# Altium schematic sheet fmu.SchDoc: myA4
size A4; Date: 2018/03/30; DrawnBy: 亓岳鑫; Organization: Altium Limited; Address1: 3 Minna Close; Address2: Belrose; Address3: NSW 2085; Address4: Australia; DocumentNumber: 4; Revision: Alfa 2.0; SheetNumber: 4; SheetTotal: 6; Time: 17:30
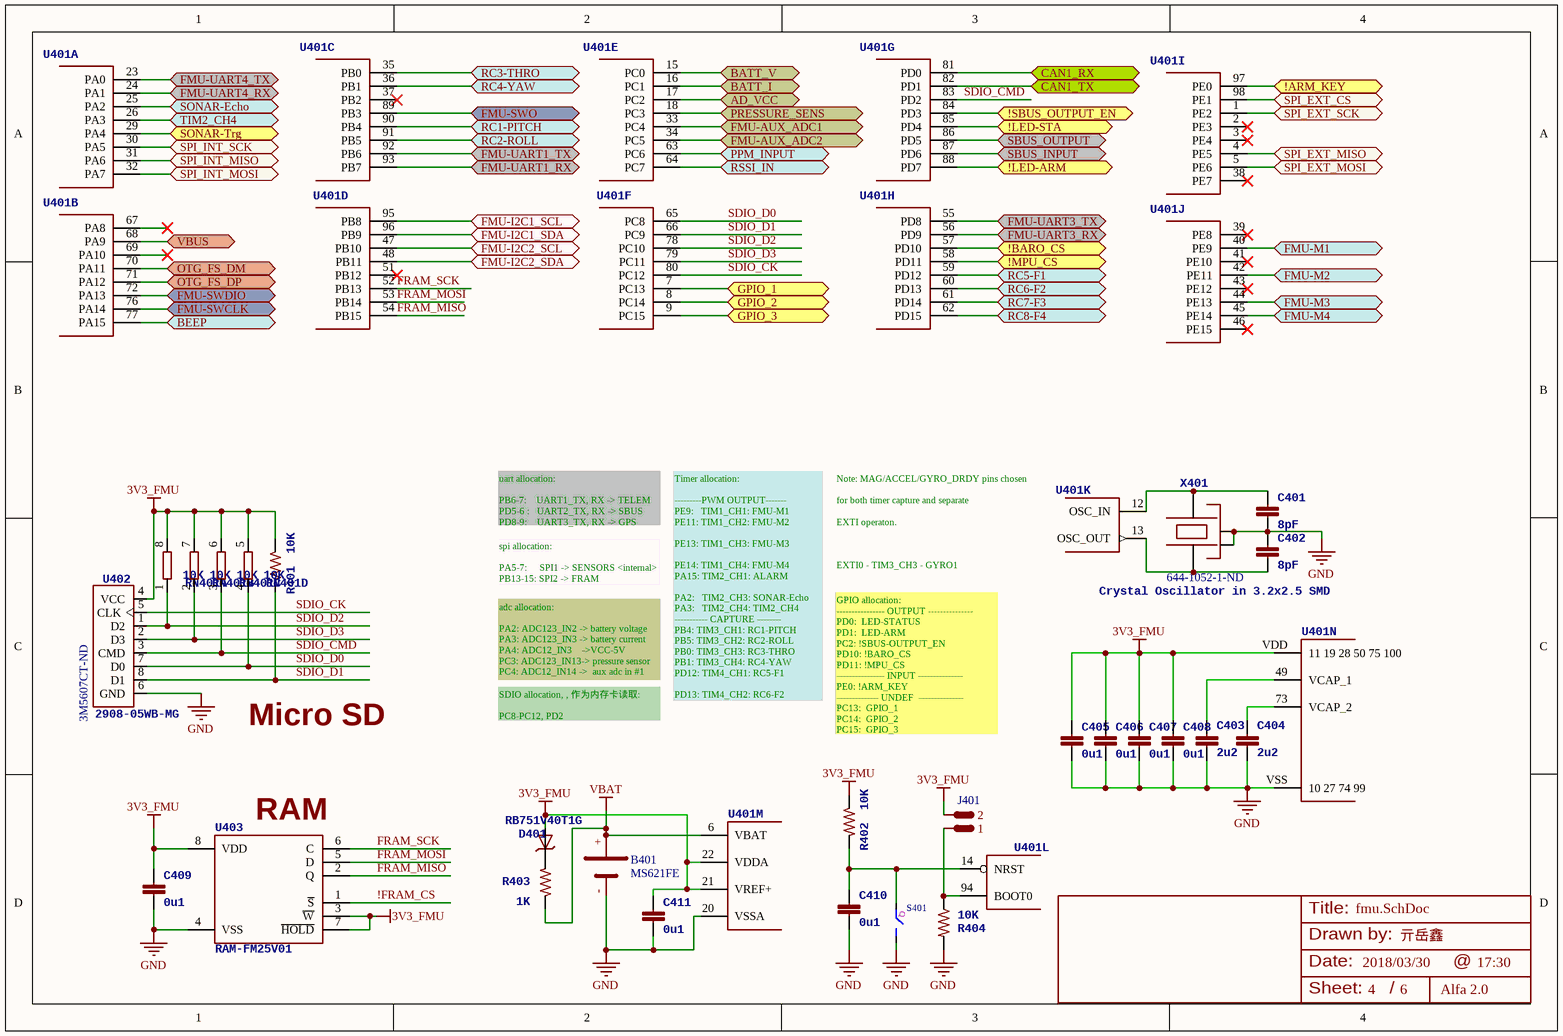
[diagram p0: fmu.SchDoc]

## Parts
B401  MS621FE  [MS621FE]
C401  8pF  [0603-CAP]
C402  8pF  [0603-CAP]
C403  2u2  [0603-CAP]
C404  2u2  [0603-CAP]
C405  0u1  [0603-CAP]
C406  0u1  [0603-CAP]
C407  0u1  [0603-CAP]
C408  0u1  [0603-CAP]
C409  0u1  [0603-CAP]
C410  0u1  [0603-CAP]
C411  0u1  [0603-CAP]
D401  RB751V40T1G  [SOD-323]
J401  HDR 2X1  [HDR2X1]  (value not drawn)
R401  10K  [0603-RES]
R402  10K  [0603-RES]
R403  1K  [0603-RES]
R404  10K  [0603-RES]
RN401  10K  [0603*4]  (parts A,B,C,D of 4)
S401  轻触开关 贴片3*6*2.5mm  [SMD-SWITCH-2P]  (value not drawn)
U401  STM32F427VI qfp 100 pin  [LQFP100]  (value not drawn)  (parts A,B,C,D,E,F,G,H,I,J,K,L,M,N of 14)
U402  2908-05WB-MG  Supplier Part Number 1: 3M5607CT-ND  [MICROSD]
U403  RAM-FM25V01  [SO08]
X401  Crystal Oscillator in 3.2x2.5 SMD  Supplier Part Number 1: 644-1052-1-ND  [3225-OSC]

## Ports
!ARM_KEY, !BARO_CS, !LED-ARM, !LED-STA, !MPU_CS, !SBUS_OUTPUT_EN, AD_VCC, BATT_I, BATT_V, BEEP, CAN1_RX, CAN1_TX, FMU-AUX_ADC1, FMU-AUX_ADC2, FMU-I2C1_SCL, FMU-I2C1_SDA, FMU-I2C2_SCL, FMU-I2C2_SDA, FMU-M1, FMU-M2, FMU-M3, FMU-M4, FMU-SWCLK, FMU-SWDIO, FMU-SWO, FMU-UART1_RX, FMU-UART1_TX, FMU-UART3_RX, FMU-UART3_TX, FMU-UART4_RX, FMU-UART4_TX, GPIO_1, GPIO_2, GPIO_3, OTG_FS_DM, OTG_FS_DP, PPM_INPUT, PRESSURE_SENS, RC1-PITCH, RC2-ROLL, RC3-THRO, RC4-YAW, RC5-F1, RC6-F2, RC7-F3, RC8-F4, RSSI_IN, SBUS_INPUT, SBUS_OUTPUT, SONAR-Echo, SONAR-Trg, SPI_EXT_CS, SPI_EXT_MISO, SPI_EXT_MOSI, SPI_EXT_SCK, SPI_INT_MISO, SPI_INT_MOSI, SPI_INT_SCK, TIM2_CH4, VBUS

## Nets
3V3_FMU: C405.P$1 C406.P$1 C407.P$1 C408.P$1 C409.P$1 C411.P$1 D401.A J401.2 R401.1 R402.1 RN401.5 RN401.6 RN401.7 RN401.8 U401.21(VREF+) U401.22(VDDA) U401.VDD(11_19_28_50_75_100) U402.4(VCC) U403.3(~{W}) U403.7(~{HOLD}) U403.8(VDD)
GND: B401.- C401.P$2 C402.P$1 C403.P$2 C404.P$2 C405.P$2 C406.P$2 C407.P$2 C408.P$2 C409.P$2 C410.P$2 C411.P$2 R404.2 S401.2 U401.20(VSSA) U401.VSS(10_27_74_99) U402.6(GND) U403.4(VSS) X401.2(NC_2) X401.4(NC_4)
VBAT: B401.+ R403.1 U401.6(VBAT)
!ARM_KEY: U401.97(PE0) ; port !ARM_KEY
!BARO_CS: U401.57(PD10) ; port !BARO_CS
!FRAM_CS: U403.1(~{S})
!LED-ARM: U401.88(PD7) ; port !LED-ARM
!LED-STA: U401.85(PD4) ; port !LED-STA
!MPU_CS: U401.58(PD11) ; port !MPU_CS
!SBUS_OUTPUT_EN: U401.84(PD3) ; port !SBUS_OUTPUT_EN
AD_VCC: U401.17(PC2) ; port AD_VCC
BATT_I: U401.16(PC1) ; port BATT_I
BATT_V: U401.15(PC0) ; port BATT_V
BEEP: U401.77(PA15) ; port BEEP
CAN1_RX: U401.81(PD0) ; port CAN1_RX
CAN1_TX: U401.82(PD1) ; port CAN1_TX
FMU-AUX_ADC1: U401.33(PC4) ; port FMU-AUX_ADC1
FMU-AUX_ADC2: U401.34(PC5) ; port FMU-AUX_ADC2
FMU-I2C1_SCL: U401.95(PB8) ; port FMU-I2C1_SCL
FMU-I2C1_SDA: U401.96(PB9) ; port FMU-I2C1_SDA
FMU-I2C2_SCL: U401.47(PB10) ; port FMU-I2C2_SCL
FMU-I2C2_SDA: U401.48(PB11) ; port FMU-I2C2_SDA
FMU-M1: U401.40(PE9) ; port FMU-M1
FMU-M2: U401.42(PE11) ; port FMU-M2
FMU-M3: U401.44(PE13) ; port FMU-M3
FMU-M4: U401.45(PE14) ; port FMU-M4
FMU-SWCLK: U401.76(PA14) ; port FMU-SWCLK
FMU-SWDIO: U401.72(PA13) ; port FMU-SWDIO
FMU-SWO: U401.89(PB3) ; port FMU-SWO
FMU-UART1_RX: U401.93(PB7) ; port FMU-UART1_RX
FMU-UART1_TX: U401.92(PB6) ; port FMU-UART1_TX
FMU-UART3_RX: U401.56(PD9) ; port FMU-UART3_RX
FMU-UART3_TX: U401.55(PD8) ; port FMU-UART3_TX
FMU-UART4_RX: U401.24(PA1) ; port FMU-UART4_RX
FMU-UART4_TX: U401.23(PA0) ; port FMU-UART4_TX
FRAM_MISO: U401.54(PB15) U403.2(Q)
FRAM_MOSI: U401.53(PB14) U403.5(D)
FRAM_SCK: U401.52(PB13) U403.6(C)
GPIO_1: U401.7(PC13) ; port GPIO_1
GPIO_2: U401.8(PC14) ; port GPIO_2
GPIO_3: U401.9(PC15) ; port GPIO_3
OTG_FS_DM: U401.70(PA11) ; port OTG_FS_DM
OTG_FS_DP: U401.71(PA12) ; port OTG_FS_DP
PPM_INPUT: U401.63(PC6) ; port PPM_INPUT
PRESSURE_SENS: U401.18(PC3) ; port PRESSURE_SENS
RC1-PITCH: U401.90(PB4) ; port RC1-PITCH
RC2-ROLL: U401.91(PB5) ; port RC2-ROLL
RC3-THRO: U401.35(PB0) ; port RC3-THRO
RC4-YAW: U401.36(PB1) ; port RC4-YAW
RC5-F1: U401.59(PD12) ; port RC5-F1
RC6-F2: U401.60(PD13) ; port RC6-F2
RC7-F3: U401.61(PD14) ; port RC7-F3
RC8-F4: U401.62(PD15) ; port RC8-F4
RSSI_IN: U401.64(PC7) ; port RSSI_IN
SBUS_INPUT: U401.87(PD6) ; port SBUS_INPUT
SBUS_OUTPUT: U401.86(PD5) ; port SBUS_OUTPUT
SDIO_CK: U401.80(PC12) U402.5(CLK)
SDIO_CMD: RN401.3 U401.83(PD2) U402.3(CMD)
SDIO_D0: RN401.4 U401.65(PC8) U402.7(D0)
SDIO_D1: R401.2 U401.66(PC9) U402.8(D1)
SDIO_D2: RN401.1 U401.78(PC10) U402.1(D2)
SDIO_D3: RN401.2 U401.79(PC11) U402.2(D3)
SONAR-Echo: U401.25(PA2) ; port SONAR-Echo
SONAR-Trg: U401.29(PA4) ; port SONAR-Trg
SPI_EXT_CS: U401.98(PE1) ; port SPI_EXT_CS
SPI_EXT_MISO: U401.4(PE5) ; port SPI_EXT_MISO
SPI_EXT_MOSI: U401.5(PE6) ; port SPI_EXT_MOSI
SPI_EXT_SCK: U401.1(PE2) ; port SPI_EXT_SCK
SPI_INT_MISO: U401.31(PA6) ; port SPI_INT_MISO
SPI_INT_MOSI: U401.32(PA7) ; port SPI_INT_MOSI
SPI_INT_SCK: U401.30(PA5) ; port SPI_INT_SCK
TIM2_CH4: U401.26(PA3) ; port TIM2_CH4
VBUS: U401.68(PA9) ; port VBUS
NetC401_P$1: C401.P$1 U401.12(OSC_IN) X401.3
NetC402_P$2: C402.P$2 U401.13(OSC_OUT) X401.1
NetC403_P$1: C403.P$1 U401.49(VCAP_1)
NetC404_P$1: C404.P$1 U401.73(VCAP_2)
NetC410_P$1: C410.P$1 R402.2 S401.1 U401.14(NRST)
NetD401_C: D401.C R403.2
NetJ401_1: J401.1 R404.1 U401.94(BOOT0)

Not connected (* = marked no-connect by the designer): U401 2(PE3)* 3(PE4)* 37(PB2)* 38(PE7)* 39(PE8)* 41(PE10)* 43(PE12)* 46(PE15)* 51(PB12)* 67(PA8)* 69(PA10)*

## Notes on the sheet
- uart allocation:
  PB6-7:    UART1_TX, RX -> TELEM
  PD5-6 :   UART2_TX, RX -> SBUS
  PD8-9:    UART3_TX, RX -> GPS
  PA0-1 :   UART4_TX, RX -> DEBUG
- spi allocation:
  PA5-7:     SPI1 -> SENSORS <internal>
  PB13-15: SPI2 -> FRAM
  PE2,5,6:  SPI4 -> external SPI
- Note: MAG/ACCEL/GYRO_DRDY pins chosen
  for both timer capture and separate
  EXTI operaton.
  EXTI0 - TIM3_CH3 - GYRO1
  EXTI1 - <free>
  EXTI2 - <free>
  EXTI3 - <free>
  EXTI4 - TIM3_CH1 - ACCEL
  EXTI5-9 - TIM3_CH2 - MAG
- adc allocation:
  PA2: ADC123_IN2 -> battery voltage
  PA3: ADC123_IN3 -> battery current
  PA4: ADC12_IN3    ->VCC-5V
  PC3: ADC123_IN13-> pressure sensor
  PC4: ADC12_IN14 ->  aux adc in #1
  PC5: ADC12_IN15  -> aux adc in #2
- SDIO allocation, , 作为内存卡读取:
  PC8-PC12, PD2
- Timer allocation:
  ---------PWM OUTPUT-------
  PE9:   TIM1_CH1: FMU-M1
  PE11: TIM1_CH2: FMU-M2
  PE13: TIM1_CH3: FMU-M3
  PE14: TIM1_CH4: FMU-M4
  PA15: TIM2_CH1: ALARM
  PA2:   TIM2_CH3: SONAR-Echo
  PA3:   TIM2_CH4: TIM2_CH4
  ----------- CAPTURE --------
  PB4: TIM3_CH1: RC1-PITCH
  PB5: TIM3_CH2: RC2-ROLL
  PB0: TIM3_CH3: RC3-THRO
  PB1: TIM3_CH4: RC4-YAW
  PD12: TIM4_CH1: RC5-F1
  PD13: TIM4_CH2: RC6-F2
  PD14: TIM4_CH3: RC7-F3
  PD15: TIM4_CH4: RC8-F4
  PC6: TIM8_CH1:PPM_IN
  PC7: TIM8_CH2:RSSI_IN
- Micro SD
- GPIO allocation:
  ---------------- OUTPUT ---------------
  PD0:  LED-STATUS
  PD1:  LED-ARM
  PC2: !SBUS-OUTPUT_EN
  PD10: !BARO_CS
  PD11: !MPU_CS
  ---------------- INPUT ---------------
  PE0: !ARM_KEY
  -------------- UNDEF  ---------------
  PC13:  GPIO_1
  PC14:  GPIO_2
  PC15:  GPIO_3
- (near U403) RAM
- Title:
- Drawn by:
- Date:
- @
- Sheet:
- /
- (in symbol SWITCH-1) Q

## Library data of the parts
B401 = BAT-MS621FE: MS Lithium Rechargeable Battery; Supplier 1: Digi-Key; Supplier Part Number 1: 728-1057-ND
C401 C402 = CAP0603-8pF: CAP CER 8PF 50v c0g 0603; Value: 8pF; Supplier 1: Digi-Key; Supplier Part Number 1: 445-5043-1-ND
C403 C404 = CAP0603-2.2uF: Capacitor, 2.2uF, 16V, 10%, X6S, 0603, Ceramic; PARTNO: C1608X6S1C225K080AC; 3DR_PARTNO: ECM0619; Supplier 1: Digi-Key; Value: 2u2; Supplier Part Number 1: 445-7438-1-ND
C405-C411 = CAP0603-0.1uF: Capacitor, 0.1uF, 16V, Y5V, 0402, Ceramic; PARTNO: CC0402ZRY5V7BB104; 3DR_PARTNO: ECM0700; Value: 0u1; Supplier 1: Digi-Key; Supplier Part Number 1: 311-1776-1-ND
D401 = DIODE-SBD_SOD323: DIODE SCHOTTKY 40V 30mA , 0.34V, SOD323; Value: 20V 1A; Supplier 1: Digi-Key; Supplier Part Number 1: NSVRB751V40T1GOSCT-ND
J401 = HDR 2X1: 排针, 2X1 pins
R401 R402 R404 = RES0603-10K: RES 10K OHM 1/10W 5% 0603; Value: 10K; Supplier 1: Digi-Key; Supplier Part Number 1: A126331TR-ND
R403 = RES0603-1K: RES 1K OHM 1/10W 5% 0603; Value: 1K; Supplier 1: Digi-Key; Supplier Part Number 1: 311-1.0KGRCT-ND
RN401 = RES4P-0603-10K: RES ARRAY 10K OHM 4 RES 0603; Value: 10K; Supplier 1: Digi-Key; Supplier Part Number 1: CAY16-22R0F4LFCT-ND
S401 = SWITCH-1: 按键 3*6*2.5mm 轻触开关 贴片2脚 白色; Revision: July-2002: Re-released for DXP Platform.
U401 = STM32F4X7VX: REV 3 Silicon or later IC MCU ARM 2MB FLASH 100LQFP; 3DR_PARTNO: ECM0841; Supplier 1: Digi-Key; Supplier Part Number 1: 497-14049-ND
U402 = MICROSD-SDI: CONN MICRO SD CARD PUSH-PUSH R/A; 3DR_PARTNO: ECM0485; PARTNO: 2908-05WB-MG; Supplier 1: Digi-Key
U403 = RAM-FM25V01: IC FRAM 128KBIT 40MHZ 8SOIC; PARTNO: FM25V01-G; 3DR_PARTNO: ECM0826; Value: 128k; DATASHEET: http://www.ramtron.com/files/datasheets/FM25V01_ds.pdf; LINK: http://www.digikey.com/product-detail/en/FM25V01-GTR/1140-1026-1-ND/2809832; MFGPN: FM25V01; Supplier 1: Digi-Key; Supplier Part Number 1: 428-3211-ND
X401 = OSCILLATOR-3225: CRYSTAL 24MHZ 8PF SMD; 3DR_PARTNO: ECM0708; PARTNO: NX3225SA-24.000MHZ-STD-CSR-1; Supplier 1: Digi-Key; Value: 24MHz